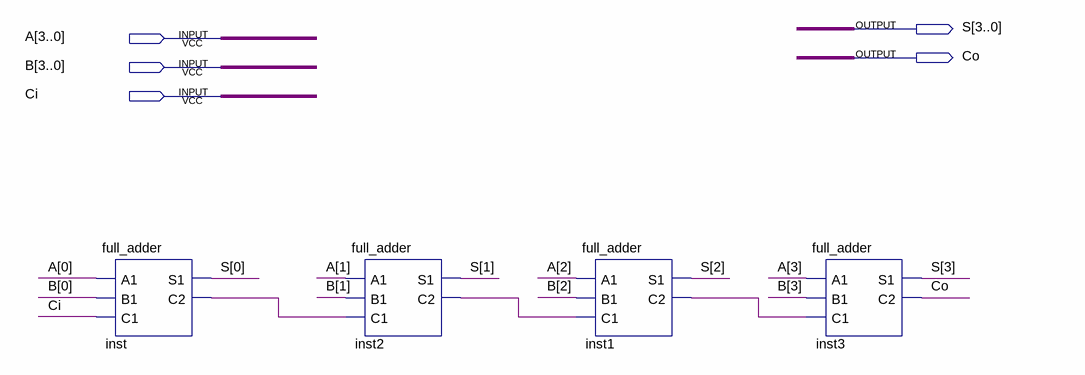
[diagram p0: schematic sheet]
// Quartus schematic adder4.bdf as structural Verilog: 4 symbols, 5 pins
module adder4 (
  input  [3:0] A,
  input  [3:0] B,
  input  Ci,
  output [3:0] S,
  output Co
);

  wire inst1_c2, inst2_c2, inst_c2;

  full_adder inst (.A1(A[0]), .B1(B[0]), .C1(Ci), .S1(S[0]), .C2(inst_c2));
  full_adder inst2 (.A1(A[1]), .B1(B[1]), .C1(inst_c2), .S1(S[1]), .C2(inst2_c2));
  full_adder inst1 (.A1(A[2]), .B1(B[2]), .C1(inst2_c2), .S1(S[2]), .C2(inst1_c2));
  full_adder inst3 (.A1(A[3]), .B1(B[3]), .C1(inst1_c2), .S1(S[3]), .C2(Co));
endmodule
